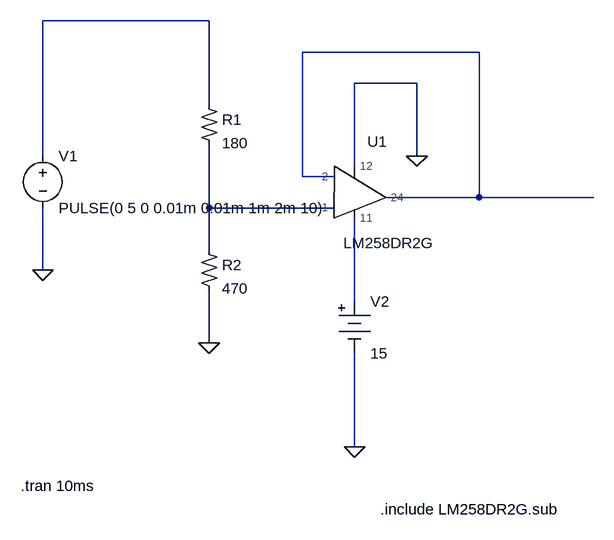
[diagram p0: schematic 5dc to 3.3dc.asc]
5dc to 3.3dc.asc, the LTspice schematic file:
Version 4
SHEET 1 880 680
WIRE -16 -1232 -272 -1232
WIRE 400 -1184 128 -1184
WIRE 304 -1136 208 -1136
WIRE -16 -1104 -16 -1232
WIRE -272 -1024 -272 -1232
WIRE 304 -1024 304 -1136
WIRE 208 -1008 208 -1136
WIRE 128 -992 128 -1184
WIRE 176 -992 128 -992
WIRE 400 -960 400 -1184
WIRE 400 -960 256 -960
WIRE 576 -960 400 -960
WIRE -16 -944 -16 -1040
WIRE 176 -944 -16 -944
WIRE -16 -880 -16 -944
WIRE -272 -848 -272 -944
WIRE 208 -800 208 -928
WIRE -16 -736 -16 -816
WIRE 208 -576 208 -720
FLAG -272 -848 0
FLAG -16 -736 0
FLAG 208 -576 0
FLAG 304 -1024 0
SYMBOL res2 -32 -1104 R0
SYMATTR InstName R1
SYMATTR Value 180
SYMBOL res2 -32 -880 R0
SYMATTR InstName R2
SYMATTR Value 470
SYMBOL Misc\\battery 208 -816 R0
WINDOW 123 0 0 Left 0
WINDOW 39 0 0 Left 0
SYMATTR InstName V2
SYMATTR Value 15
SYMBOL LM258DR2G 32 -960 R0
SYMATTR InstName U1
SYMBOL voltage -272 -1040 R0
WINDOW 123 0 0 Left 0
WINDOW 39 0 0 Left 0
SYMATTR InstName V1
SYMATTR Value PULSE(0 5 0 0.01m 0.01m 1m 2m 10)
TEXT -306 -516 Left 2 !.tran 10ms
TEXT 248 -480 Left 2 !.include LM258DR2G.sub

The netlist it stands for:
* 5dc to 3.3dc.asc
R1 N001 N003 180
R2 N003 0 470
V2 N004 0 15
XU1 N003 N002 N004 0 N002 LM258DR2G  ; pins 1 2 11 12 24
V1 N001 0 PULSE(0 5 0 0.01m 0.01m 1m 2m 10)
.tran 10ms
.include LM258DR2G.sub
.lib H:\D5\Interface\Ltspice Model\LM258DR2G.sub
.backanno
.end